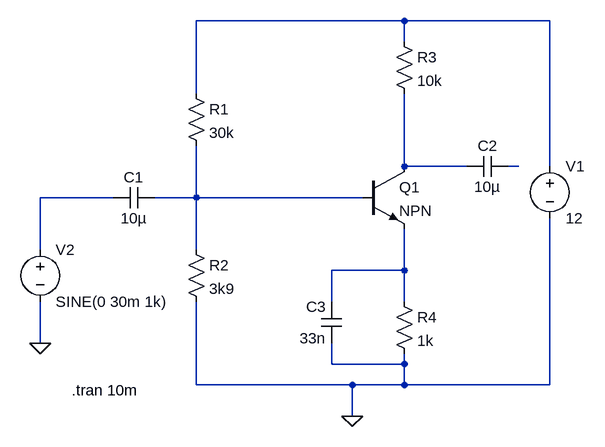
[diagram p0: schematic Amplifier.asc]
Amplifier.asc, the LTspice schematic file:
Version 4.1
SHEET 1 880 680
WIRE 240 -96 -80 -96
WIRE 464 -96 240 -96
WIRE 240 -64 240 -96
WIRE -80 16 -80 -96
WIRE 240 128 240 16
WIRE 336 128 240 128
WIRE 416 128 400 128
WIRE 464 128 464 -96
WIRE -208 176 -320 176
WIRE -80 176 -80 96
WIRE -80 176 -144 176
WIRE 176 176 -80 176
WIRE -320 256 -320 176
WIRE -80 256 -80 176
WIRE 240 288 240 224
WIRE 240 288 128 288
WIRE 128 336 128 288
WIRE 240 336 240 288
WIRE -320 400 -320 336
WIRE 128 432 128 400
WIRE 240 432 240 416
WIRE 240 432 128 432
WIRE -80 464 -80 336
WIRE 160 464 -80 464
WIRE 240 464 240 432
WIRE 240 464 160 464
WIRE 464 464 464 208
WIRE 464 464 240 464
WIRE 160 512 160 464
FLAG -320 400 0
FLAG 160 512 0
SYMBOL npn 176 128 R0
SYMATTR InstName Q1
SYMBOL res -96 0 R0
SYMATTR InstName R1
SYMATTR Value 30k
SYMBOL res -96 240 R0
SYMATTR InstName R2
SYMATTR Value 3k9
SYMBOL res 224 -80 R0
SYMATTR InstName R3
SYMATTR Value 10k
SYMBOL res 224 320 R0
SYMATTR InstName R4
SYMATTR Value 1k
SYMBOL voltage 464 112 R0
WINDOW 123 0 0 Left 0
WINDOW 39 0 0 Left 0
SYMATTR InstName V1
SYMATTR Value 12
SYMBOL voltage -320 240 R0
WINDOW 123 0 0 Left 0
WINDOW 39 0 0 Left 0
SYMATTR InstName V2
SYMATTR Value SINE(0 30m 1k)
SYMBOL cap -144 160 R90
WINDOW 0 0 32 VBottom 2
WINDOW 3 32 32 VTop 2
SYMATTR InstName C1
SYMATTR Value 10µ
SYMBOL cap 400 112 R90
WINDOW 0 0 32 VBottom 2
WINDOW 3 32 32 VTop 2
SYMATTR InstName C2
SYMATTR Value 10µ
SYMBOL cap 144 400 R180
WINDOW 0 24 56 Left 2
WINDOW 3 24 8 Left 2
SYMATTR InstName C3
SYMATTR Value 33n
TEXT -272 472 Left 2 !.tran 10m

The netlist it stands for:
* Amplifier.asc
Q1 N002 N005 N006 0 NPN
R1 N001 N005 30k
R2 N005 0 3k9
R3 N001 N002 10k
R4 N006 0 1k
V1 N001 0 12
V2 N004 0 SINE(0 30m 1k)
C1 N005 N004 10µ
C2 N003 N002 10µ
C3 0 N006 33n
.model NPN NPN
.model PNP PNP
.lib standard.bjt
.tran 10m
.backanno
.end